# Altium project D_amplifier.PrjPcb (part 2 of 3)
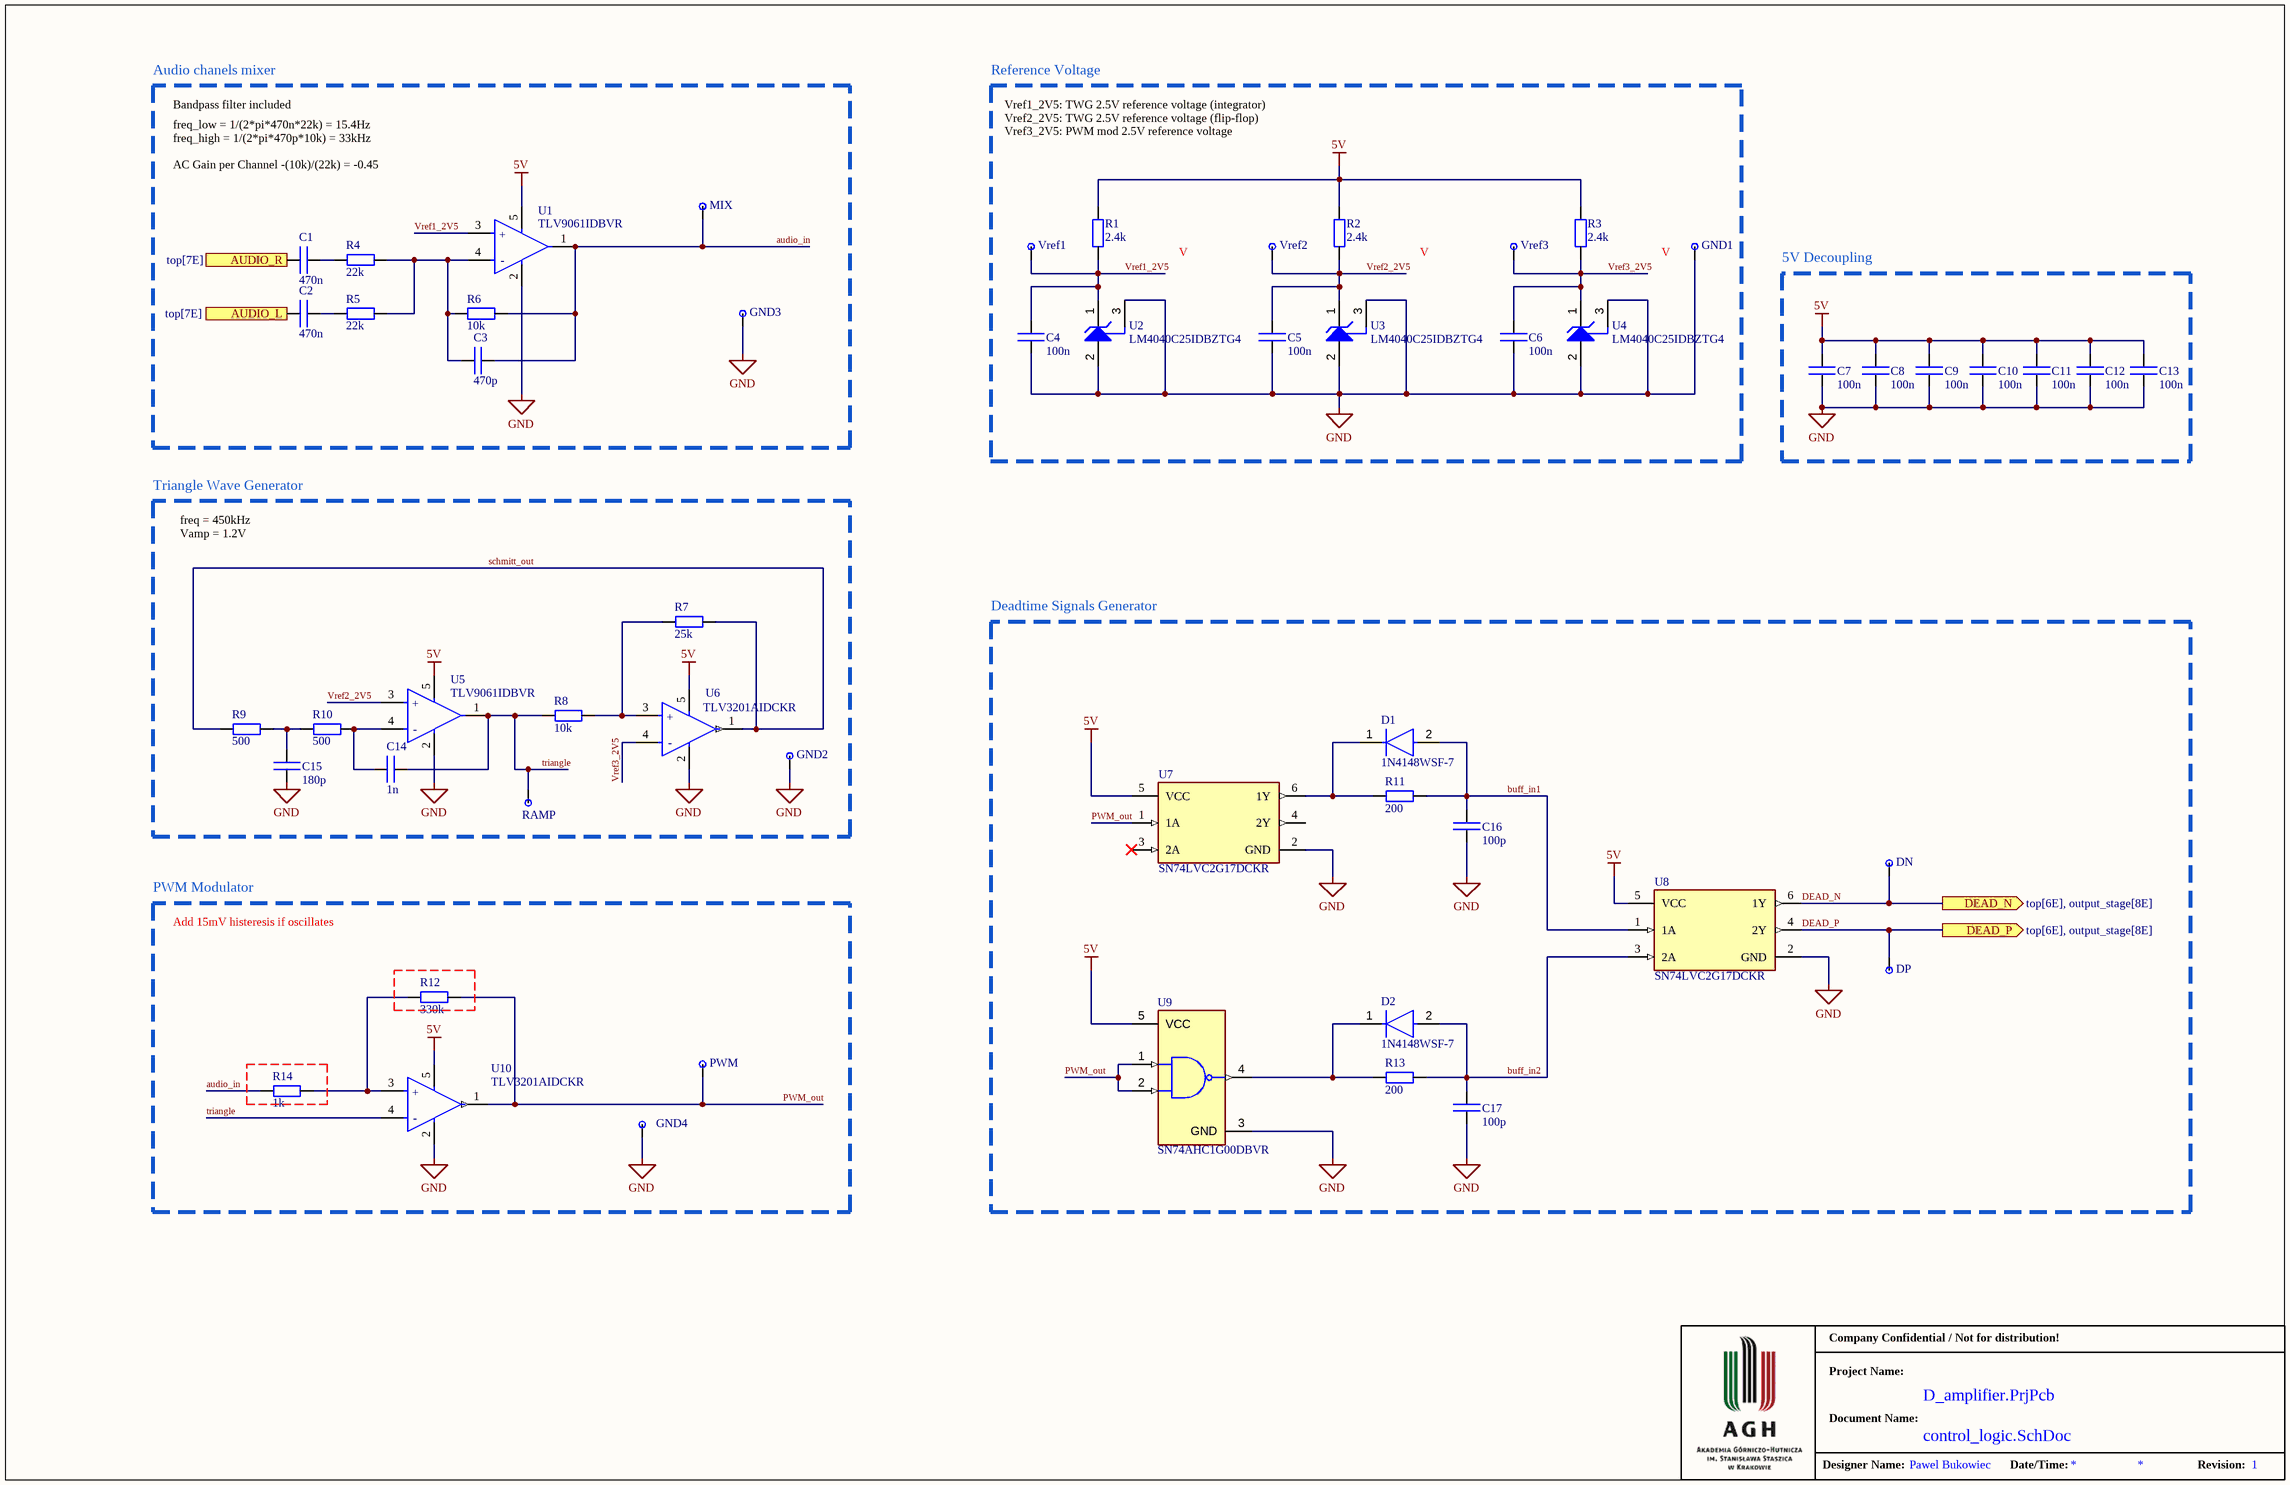
[diagram p5: control_logic.SchDoc]

## Sheet control_logic.SchDoc (continued)

### Parts
C1  470n  [CAP_1206]
C2  470n  [CAP_1206]
C3  470p  [CAP_IPC_0805_133A]
C4  100n  [CAP_IPC_0805_133A]
C5  100n  [CAP_IPC_0805_133A]
C6  100n  [CAP_IPC_0805_133A]
C7  100n  [CAP_IPC_0805_133A]
C8  100n  [CAP_IPC_0805_133A]
C9  100n  [CAP_IPC_0805_133A]
C10  100n  [CAP_IPC_0805_133A]
C11  100n  [CAP_IPC_0805_133A]
C12  100n  [CAP_IPC_0805_133A]
C13  100n  [CAP_IPC_0805_133A]
C14  1n  [CAP_IPC_0805_133A]
C15  180p  [CAP_IPC_0805_133A]
C16  100p  [CAP_IPC_0805_133A]
C17  100p  [CAP_IPC_0805_133A]
D1  1N4148WSF-7  [1N4148]
D2  1N4148WSF-7  [1N4148]
DN  TestPoint  [TestPoint_SMT]  (value not drawn)
DP  TestPoint  [TestPoint_SMT]  (value not drawn)
GND1  TestPoint  [TestPoint_SMT]  (value not drawn)
GND2  TestPoint  [TestPoint_SMT]  (value not drawn)
GND3  TestPoint  [TestPoint_SMT]  (value not drawn)
GND4  TestPoint  [TestPoint_SMT]  (value not drawn)
MIX  TestPoint  [TestPoint_SMT]  (value not drawn)
PWM  TestPoint  [TestPoint_SMT]  (value not drawn)
R1  2.4k  [RES_VJ_0402_MD]
R2  2.4k  [RES_VJ_0402_MD]
R3  2.4k  [RES_VJ_0402_MD]
R4  22k  [RES_VJ_0402_MD]
R5  22k  [RES_VJ_0402_MD]
R6  10k  [RES_VJ_0402_MD]
R7  25k  [RES_VJ_0402_MD]
R8  10k  [RES_VJ_0402_MD]
R9  500  [RES_VJ_0402_MD]
R10  500  [RES_VJ_0402_MD]
R11  200  [RES_VJ_0402_MD]
R12  330k  [RES_VJ_0402_MD]
R13  200  [RES_VJ_0402_MD]
R14  1k  [RES_VJ_0402_MD]
RAMP  TestPoint  [TestPoint_SMT]  (value not drawn)
U1  TLV9061IDBVR  [TLV9061]
U2  LM4040C25IDBZTG4  [LM4040C25]
U3  LM4040C25IDBZTG4  [LM4040C25]
U4  LM4040C25IDBZTG4  [LM4040C25]
U5  TLV9061IDBVR  [TLV9061]
U6  TLV3201AIDCKR  [TLV3201]
U7  SN74LVC2G17DCKR  [SN74LVC2G17DCKR]
U8  SN74LVC2G17DCKR  [SN74LVC2G17DCKR]
U9  SN74AHC1G00DBVR  [SN74AHC1G00DBVR]
U10  TLV3201AIDCKR  [TLV3201]
Vref1  TestPoint  [TestPoint_SMT]  (value not drawn)
Vref2  TestPoint  [TestPoint_SMT]  (value not drawn)
Vref3  TestPoint  [TestPoint_SMT]  (value not drawn)

### Blocks framed on the sheet
Audio chanels mixer: C1-C3 GND3 MIX R4-R6 U1
Reference Voltage: C4-C6 GND1 R1-R3 U2-U4 Vref1-Vref3
5V Decoupling: C7-C13
Triangle Wave Generator: C14 C15 GND2 R7-R10 RAMP U5 U6
Deadtime Signals Generator: C16 C17 D1 D2 DN DP R11 R13 U7-U9
PWM Modulator: GND4 PWM R12 R14 U10

### Ports
AUDIO_L (in, see top[7E]), AUDIO_R (in, see top[7E]), DEAD_N (out, see top[6E], output_stage[8E]), DEAD_P (out, see top[6E], output_stage[8E])

### Nets
5V: C7.1 C8.1 C9.1 C10.1 C11.1 C12.1 C13.1 R1.1 R2.1 R3.1 U1.5(V+) U5.5(V+) U6.5(VCC) U7.5(VCC) U8.5(VCC) U9.5(VCC) U10.5(VCC)
GND: C4.2 C5.2 C6.2 C7.2 C8.2 C9.2 C10.2 C11.2 C12.2 C13.2 C15.2 C16.2 C17.2 GND1.1 GND2.1 GND3.1 GND4.1 U1.2(V-) U2.2(ANODE) U2.3(NC) U3.2(ANODE) U3.3(NC) U4.2(ANODE) U4.3(NC) U5.2(V-) U6.2(GND) U7.2(GND) U8.2(GND) U9.3(GND) U10.2(GND)
AUDIO_CH_L: C2.1 ; port AUDIO_L
AUDIO_CH_R: C1.1 ; port AUDIO_R
audio_in: C3.2 MIX.1 R6.2 R14.1 U1.1(OUT)
buff_in1: C16.1 D1.2(A) R11.2 U8.1(1A)
buff_in2: C17.1 D2.2(A) R13.2 U8.3(2A)
DEAD_N: DN.1 U8.6(1Y) ; port DEAD_N
DEAD_P: DP.1 U8.4(2Y) ; port DEAD_P
PWM_out: PWM.1 R12.2 U7.1(1A) U9.1(A) U9.2(B) U10.1(OUT)
schmitt_out: R7.2 R9.1 U6.1(OUT)
triangle: C14.2 R8.1 RAMP.1 U5.1(OUT) U10.4(IN-)
Vref1_2V5: C4.1 R1.2 U1.3(IN+) U2.1(CATHODE) Vref1.1
Vref2_2V5: C5.1 R2.2 U3.1(CATHODE) U5.3(IN+) Vref2.1
Vref3_2V5: C6.1 R3.2 U4.1(CATHODE) U6.4(IN-) Vref3.1
NetC1_2: C1.2 R4.1
NetC2_2: C2.2 R5.1
NetC3_1: C3.1 R4.2 R5.2 R6.1 U1.4(IN-)
NetC14_1: C14.1 R10.2 U5.4(IN-)
NetC15_1: C15.1 R9.2 R10.1
NetD1_1: D1.1(C) R11.1 U7.6(1Y)
NetD2_1: D2.1(C) R13.1 U9.4(Y)
NetR7_1: R7.1 R8.2 U6.3(IN+)
NetR12_1: R12.1 R14.2 U10.3(IN+)

Not connected (* = marked no-connect by the designer): U7 3(2A)* 4(2Y)

### Notes on the sheet
- Bandpass filter included
- freq_low = 1/(2*pi*470n*22k) = 15.4Hz
- freq_high = 1/(2*pi*470p*10k) = 33kHz
- AC Gain per Channel -(10k)/(22k) = -0.45
- Vref1_2V5: TWG 2.5V reference voltage (integrator)
- Vref2_2V5: TWG 2.5V reference voltage (flip-flop)
- Vref3_2V5: PWM mod 2.5V reference voltage
- freq = 450kHz
- Vamp = 1.2V
- Add 15mV histeresis if oscillates
- Project Name:
- Company Confidential / Not for distribution!
- Document Name:
- Designer Name:
- Date/Time:
- Revision:
- (in symbol TLV3201) +
- (in symbol TLV9061) +; -

### Library data of the parts
C1 C2 = Capacitor: Manufacturer: *; Part Number: *; Value: 470n
C3 = Capacitor: Dielectric: C0G; Voltage: 10; Manufacturer: *; Part Number: *; Value: 470p
C4-C13 = Capacitor: Dielectric: X7R; Voltage: 16; Manufacturer: *; Part Number: *; Value: 100n
C14 C15 = Capacitor: Dielectric: C0G; Volatge: 16; Manufacturer: *; Part Number: *
  C14: Value: 1n
  C15: Value: 180p
C16 C17 = Capacitor: Dielectric: C0G; Volatge: 10; Manufacturer: *; Part Number: *; Value: 100p
D1 D2 = 1N4148: DIODE GEN PURP 100V 250MA SOD323; Manufacturer: Diodes Inc.; Value: 1.5pF; Max Surge Forward Current: 0.5A; Peak Reverse Current: 0.5uA; Max Junction Temp: +150°C; Height: 0.75mm; Digikey Description: DIODE GEN PURP 100V 250MA SOD323; Automotive: No; Footprint Url: https://www.diodes.com/assets/Package-Files/SOD323F.pdf; Category: Diode; Manufacturer Part Number: 1N4148WSF-7; Max Repetitive Reverse Voltage: 100V; Lead Free: Yes; Temperature Range High: +150°C; Forward Current: 250mA; Reverse Voltage: 100V; Device Class L3: Rectifier Diodes; ComponentLink2URL: https://www.diodes.com/assets/Datasheets/1N4148WSF.pdf; Package: SOD323F; RoHS: TRUE; Mouser Description: Diodes - General Purpose, Power, Switching 200mW 2pF 75Vrrm 150mA 2A 1VF; Temperature: -55°C to +150°C; Capacitance: 1.5pF; Device Class L2: Diodes; ComponentLink2Description: Datasheet; Device Class L1: Discrete Semiconductors; Octopart: https://octopart.com/1n4148wsf-7-diodes+inc.-33798544; Temperature Range Low: -55°C
DN DP GND1-GND4 MIX PWM RAMP Vref1-Vref3 = TestPoint: Test Point
R1-R14 = Resistor: Manufacturer: *; Part Number: *; ComponentLink1Description: HelpURL; ComponentLink1URL: *
  R1-R3: Value: 2.4k
  R4 R5: Value: 22k
  R6 R8: Value: 10k
  R7: Value: 25k
  R9 R10: Value: 500
  R11 R13: Value: 200
  R12: Value: 330k
  R14: Value: 1k
U1 U5 = TLV9061: IC CMOS 1 CIRCUIT SOT23-5; Gain Bandwidth Product: 10MHz; Operating Supply Current: 538uA; Output Current per Channel: 50mA; Number of Circuits: 1; Input Bias Current: 0.5pA; Input Offset Voltage (Vos): 300uV; Slew Rate: 6.5V/µs; Min Operating Temperature: -40°C; Packaging: Cut Tape; RoHS Compliant: Yes; Mount: Surface Mount; Max Operating Temperature: 125°C; Case/Package: SOT-23-6
U2-U4 = LM4040C25: Precision Micropower Shunt Voltage Reference, 0.5% accuracy, 2.5 V, 15 ppm / degC, 15 mA, -40 to 85 degC, 3-pin SOT-23 (DBZ), Green (RoHS & no Sb/Br); Manufacturer: Texas Instruments; Temp Coeff(Max)(ppm/ degree C): 100; VO(V): 2.5; Rating: Catalog; Min Iz for Regulation(uA): 75; Temp Coeff(Typ)(ppm/ degree C): 15; Initial Accuracy @ 25/deg C(%): 0.5; PartNumber: LM4040C25IDBZTG4; PackageDescription: 3-Pin Plastic Small Outline, Body 2.92 x 1.3 mm, Pitch 0.95 mm; PackageVersion: 4203227/B; ComponentLink3URL: http://www.ti.com/litv/pdf/mpds108a; ComponentLink2URL: http://www.ti.com/general/docs/lit/getliterature.tsp?genericPartNumber=LM4040C25&fileType=pdf; Mounting Technology: Surface Mount; ComponentLink3Description: Package Specification; ComponentLink1URL: http://www.ti.com/; DatasheetVersion: SLOS456K; PackageReference: DBZ3; ComponentLink1Description: Manufacturer URL; Eco-Plan: Green (RoHS & no Sb/Br); SubFamily: Shunt Voltage Reference; Code_JEDEC: TO-236; Iout/Iz(Max)(mA): 15; ComponentLink2Description: Datasheet
U6 U10 = TLV3201: IC COMPARATOR RRI SGL SC70-5; Output Type: PUSH-PULL; Max Supply Current: 40uA; Nominal Supply Current: 50uA; Propagation Delay: 50ns; Max Input Current: 5nA; Input Offset Voltage (Vos): 5mV; Number of Channels: 1; Power Supply Rejection Ratio (PSRR): 85dB; Hysteresis: 1.2mV; Min Supply Voltage: 2.7V; Max Supply Voltage: 5.5V; Response Time: 0.047us; Series: -; Case/Package: SOT-23-5; Packaging: Tape and Reel; Number of Pins: 5; RoHS Compliant: Yes; Min Operating Temperature: -40°C; Mount: Surface Mount; Radiation Hardening: No; Number of Elements: 1; Input Bias Current: 5nA; Lead Free: Lead Free; Max Operating Temperature: 125°C; Supply Current: 50uA; Type: General Purpose; Common Mode Rejection Ratio: 85dB; Package Quantity: 3000; Quiescent Current: 40uA
U7 U8 = SN74LVC2G17DCKR: IC BUF NON-INVERT 5.5V SC70-6; Schmitt Trigger Input: Yes; Number of Inputs: 2; Propagation Delay: 4.3ns; Number of Bits per Element: 1; Logic Function: Schmitt Trigger; Polarity: Non-Inverting; Low Level Output Current: 32mA; High Level Output Current: -32mA; Min Supply Voltage: 1.65V; Nominal Supply Current: 250mA; Quiescent Current: 10uA; Turn-On Delay Time: 9.3ns; Number of Pins: 6; Number of Channels: 2; Length: 2mm; Min Operating Temperature: -40°C; Contact Plating: Gold; Lead Free: Lead Free; Termination: SMD/SMT; Width: 1.25mm; Package Quantity: 1; REACH SVHC: No SVHC; Number of Bits: 2; Max Supply Voltage: 5.5V; Number of Output Lines: 2; Mount: Surface Mount; Number of Circuits: 2; Packaging: Tape and Reel; Case/Package: SC; Number of Input Lines: 2; Number of Gates: 2; RoHS Compliant: Yes; Height: 0.9mm; Max Operating Temperature: 125°C; Number of Elements: 2; Number of Outputs: 2; Radiation Hardening: No
U9 = SN74AHC1G00DBVR: IC GATE NAND 1CH 2-INP SOT23-5; Manufacturer: Texas Instruments; Standoff Height: 0mm; Number Of Outputs: 1; Nominal Supply Current: 1uA; Max Junction Temp: +150°C; Propagation Delay: 5.2ns; Min Supply Voltage: 2V; Max Supply Voltage: 5.5V; Number Of Inputs: 2; Category: IC; Logic Function Desc: NAND; Ambient Temperature Range High: +125°C; Automotive: No; Octopart: https://octopart.com/sn74ahc1g00dbvr-texas+instruments-464400; Device Class L1: Integrated Circuits (ICs); Device Class L2: Logic ICs; RoHS: TRUE; Height: 1.45mm; Digikey Description: IC GATE NAND 1CH 2-INP SOT23-5; Lead Free: Yes; Ambient Temperature Range Low: -40°C; Number Of Circuits: 1; Device Class L3: Logic Gates; Package: DBV0005A; Manufacturer Part Number: SN74AHC1G00DBVR; ComponentLink2URL: https://www.ti.com/lit/ds/symlink/sn74ahc1g00.pdf; Temperature Range Low: -40°C; Temperature: -40°C to +125°C; Temperature Range High: +125°C; ComponentLink2Description: Datasheet

## Sheet output_stage.SchDoc
size 431 x 279 mm; Author: Pawel Bukowiec; Organization: ORGANIZATION; Address1: ADDRESS 1; Address2: ADDRESS 2; Address3: ADDRESS 3; Address4: ADDRESS 4; Revision: 1; SheetNumber: 5; SheetTotal: 5; ENG_APP_DATE: --/--/--; DSN_APP_DATE: --/--/--; CHK_APP_DATE: --/--/--; SPICEModelCacheNCNDFIAY: <root> / <DocumentId>NCNDFIAY</DocumentId> / <CacheFrame Number="0"> / <Model Name="irfz24n" Kind="CKT"> / <Text>.SUBCKT irfz24n 1 2 3 / ************************************** / *      Model Generated by MODPEX     * / *Copyright(c) Symmetry Design Systems* / *         All Rights Reserved        * / *    UNPUBLISHED LICENSED SOFTWARE   * / *   Contains Proprietary Information * / *      Which is The Property of      * / *     SYMMETRY OR ITS LICENSORS      * / *Commercial Use or Resale Restricted * / *   by Symmetry License Agreement    * / ************************************** / * Model generated on Apr 24, 96 / * Model format: SPICE3 / * Symmetry POWER MOS Model (Version 1.0) / * External Node Designations / * Node 1 -&gt; Drain / * Node 2 -&gt; Gate / * Node 3 -&gt; Source / M1 9 7 8 8 MM L=100u W=100u / * Default values used in MM: / * The voltage-dependent capacitances are / * not included. Other default values are: / *   RS=0 RD=0 LD=0 CBD=0 CBS=0 CGBO=0 / .MODEL MM NMOS LEVEL=1 IS=1e-32 / +VTO=3.6319 LAMBDA=0 KP=8.99346 / +CGSO=3.09714e-06 CGDO=1.6185e-07 / RS 8 3 0.0409355 / D1 3 1 MD / .MODEL MD D IS=1.43387e-10 RS=0.0112766 N=1.28803 BV=55 / +IBV=0.00025 EG=1.2 XTI=2.96465 TT=0 / +CJO=2.96476e-10 VJ=0.50803 M=0.3 FC=0.5 / RDS 3 1 2.2e+06 / RD 9 1 0.0001 / RG 2 7 2.4575 / D2 4 5 MD1 / * Default values used in MD1: / *   RS=0 EG=1.11 XTI=3.0 TT=0 / *   BV=infinite IBV=1mA / .MODEL MD1 D IS=1e-32 N=50 / +CJO=4.37817e-10 VJ=0.5 M=0.578699 FC=1e-08 / D3 0 5 MD2 / * Default values used in MD2: / *   EG=1.11 XTI=3.0 TT=0 CJO=0 / *   BV=infinite IBV=1mA / .MODEL MD2 D IS=1e-10 N=0.4 RS=3e-06 / RL 5 10 1 / FI2 7 9 VFI2 -1 / VFI2 4 0 0 / EV16 10 0 9 7 1 / CAP 11 10 6.81971e-10 / FI1 7 9 VFI1 -1 / VFI1 11 6 0 / RCAP 6 10 1 / D4 0 6 MD3 / * Default values used in MD3: / *   EG=1.11 XTI=3.0 TT=0 CJO=0 / *   RS=0 BV=infinite IBV=1mA / .MODEL MD3 D IS=1e-10 N=0.4 / .ENDS</Text> / </Model> / <Model Name="and2_basic_gen" Kind="CKT"> / <Text>*$ / .SUBCKT AND2_BASIC_GEN A B Y PARAMS: VDD=1 VSS=0 VTHRESH=0.5 / E_ABMGATE    YINT 0 VALUE {{IF(V(A) &gt; {VTHRESH}  &amp; / + V(B) &gt; {VTHRESH},{VDD},{VSS})}} / RINT YINT Y 1 / CINT Y 0 1n / .ENDS AND2_BASIC_GEN</Text> / </Model> / <Model Name="comphys_basic_gen" Kind="CKT"> / <Text>*$ / .SUBCKT COMPHYS_BASIC_GEN INP INM HYS OUT PARAMS: VDD=1 VSS=0 VTHRESH=0.5 / EIN INP1 INM1 INP INM 1 / EHYS INP1 INP2 VALUE { IF( V(1) &gt; {VTHRESH},-V(HYS),0) } / EOUT OUT 0 VALUE { IF( V(INP2)&gt;V(INM1), {VDD} ,{VSS}) } / R1 OUT 1 1 / C1 1 0 5.0n / RINP1 INP1 0 1K / .ENDS COMPHYS_BASIC_GEN</Text> / </Model> / <Model Name="nmos01" Kind="MDL"> / <Text>*$ / ** Wrapper definitions for AA legacy support ** / ****************************** / .model NMOS01 nmos / + vto=2 / + kp=0.55 / + lambda=0.001</Text> / </Model> / <Model Name="buf_basic_gen" Kind="CKT"> / <Text>*$ / .SUBCKT BUF_BASIC_GEN A  Y PARAMS: VDD=1 VSS=0 VTHRESH=0.5 / E_ABMGATE    YINT 0 VALUE {{IF(V(A) &gt; {VTHRESH} , / + {VDD},{VSS})}} / RINT YINT Y 1 / CINT Y 0 1n / .ENDS BUF_BASIC_GEN</Text> / </Model> / <Model Name="falling_delay" Kind="CKT"> / <Text>****************************** / *$ / .subckt falling_delay in out params: delay=100n vdd=1 vss=0 vthresh=0.5 / x_u1         int out buf_basic_gen params: vdd={vdd} vss={vss} vthresh= / + {vthresh} / r_r1         in int  {delay/(0.693 * 1e-9)} / c_c1         0 int  1n / d_d1         in int dd / .model dd d / + is=1e-015 / + n=1 / + tt=1e-011 / .ends falling_delay</Text> / <Dependency>0\buf_basic_gen</Dependency> / </Model> / <Model Name="nsw_ps" Kind="CKT"> / <Text>*$ / .SUBCKT NSW_PS D G S PARAMS: RONval=10k VTHval=0.7 VCHARval=0.01 CGval=0.01pF CDval=0.01pF CSval=0.01pf / RDDUM D 0 1e11 / RSDUM S 0 1e11 / RGDUM G 0 1e11 / CG G D {CGval} / CD D S {CDval} / CS G S {CSval} / ***EEXP F1 0 VALUE={LIMIT(((V(G,S)-VTHval)/VCHARval),-80,80)} / Etest test 0 VALUE={IF(V(D) &gt; V(S), V(G,S), V(G,D))} / GOUT D S VALUE={V(D,S)/(RONval*(1+EXP(-LIMIT(((V(test)-VTHval)/VCHARval),-80,80))))} / .ENDS NSW_PS</Text> / </Model> / <Model Name="psw_ps" Kind="CKT"> / <Text>*$ / .SUBCKT PSW_PS D G S PARAMS: RONval=10k VTHval=0.7 VCHARval=0.01 CGval=0.01pF CDval=0.01pF / RDDUM D 0 1e11 / RSDUM S 0 1e11 / RGDUM G 0 1e11 / CG G D {CGval} / CD D S {CDval} / Etest test 0 VALUE={IF(V(S) &gt; V(D), V(S,G), V(D,G))} / GOUT S D VALUE={V(S,D)/(RONval*(1+EXP(-LIMIT(((V(test)-VTHval)/VCHARval),-80,80))))} / .ENDS PSW_PS</Text> / </Model> / <Model Name="buffer_ps" Kind="CKT"> / <Text>*$ / .SUBCKT BUFFER_PS A Y PARAMS: vhi=1 vlo=0 vthresh=500e-3 tplh=1e-9 tphl=1e-9 tr=1e-9 tf=1e-9 / RA A 0 1e11 / CA A 0 0.01pF / VS VSUP 0 DC 1 / EBUF1 Ypp 0 VALUE={IF(V(A) &gt; ({vthresh}), 1, 0)} / ROUTpp Ypp 0 1e11 / XNSW1 OUTp Ypp 0 NSW_PS PARAMS: RONval={(tplh+1e-15)/(1e-12*0.693)} VTHval=0.5 / XPSW1 OUTp Ypp VSUP PSW_PS PARAMS: RONval={(tphl+1e-15)/(1e-12*0.693)} VTHval=0.5 / CDEL1 OUTp 0 1pF / ETHRESH Yp 0 VALUE={IF(V(OUTp) &gt; 0.5, 1, 0)} / ROUTp Yp 0 1e11 / XNSW2 OUTr Yp 0 NSW_PS PARAMS: RONval={(tf+1e-15)/(1e-12*2.3)} VTHval=0.5 / XPSW2 OUTr Yp VSUP PSW_PS PARAMS: RONval={(tr+1e-15)/(1e-12*2.3)} VTHval=0.5 / CDEL2 OUTr 0 1pF / EOUT OUTf 0 VALUE={V(OUTr)*({vhi} - {vlo})+{vlo}} / RDR OUTf Y  1000 / RO Y 0 1e11 / .ENDS BUFFER_PS</Text> / <Dependency>0\nsw_ps</Dependency> / <Dependency>0\psw_ps</Dependency> / </Model> / <Model Name="pmos01" Kind="MDL"> / <Text>*$ / ****************************** / .model PMOS01 pmos / + vto=-2 / + kp=0.772 / + lambda=0.001</Text> / </Model> / <Model Name="d_d1" Kind="CKT"> / <Text>*$ / ****************************** / .subckt d_d1 1 2 / d1 1 2 dd1 / .model dd1 d / + is=1e-015 / + tt=1e-011 / + rs=0.05 / + n=1 / .ends d_d1</Text> / </Model> / <Model Name="and3_basic_gen" Kind="CKT"> / <Text>*$ / .SUBCKT AND3_BASIC_GEN A B C Y PARAMS: VDD=1 VSS=0 VTHRESH=0.5 / E_ABMGATE    YINT 0 VALUE {{IF(V(A) &gt; {VTHRESH}  &amp; / + V(B) &gt; {VTHRESH} &amp; / + V(C) &gt; {VTHRESH},{VDD},{VSS})}} / RINT YINT Y 1 / CINT Y 0 1n / .ENDS AND3_BASIC_GEN</Text> / </Model> / <Model Name="nand2_basic_gen" Kind="CKT"> / <Text>*$ / .SUBCKT NAND2_BASIC_GEN A B Y PARAMS: VDD=1 VSS=0 VTHRESH=0.5 / E_ABMGATE    YINT 0 VALUE {{IF(V(A) &gt; {VTHRESH}  &amp; / + V(B) &gt; {VTHRESH},{VSS},{VDD})}} / RINT YINT Y 1 / CINT Y 0 1n / .ENDS NAND2_BASIC_GEN</Text> / </Model> / <Model Name="ucc27282" Kind="CKT"> / <Text>* * source UCC27282 / ***************************************************************************** / * (C) Copyright 2018 Texas Instruments Incorporated. All rights reserved. / ***************************************************************************** / ** This model is designed as an aid for customers of Texas Instruments. / ** TI and its licensors and suppliers make no warranties, either expressed / ** or implied, with respect to this model, including the warranties of / ** merchantability or fitness for a particular purpose. The model is / ** provided solely on an "as is" basis. The entire risk as to its quality / ** and performance is with the customer. / ***************************************************************************** / * / * Released by: WEBENCH Design Center, Texas Instruments Inc. / * Part: UCC27282 / * Date: 10/31/2018 / * Model Type: Transient / * Simulator: PSPICE / * Simulator Version: 16.2 / * EVM Order Number: / * EVM Users Guide: SLUUBM2 / * Datasheet: SNVSAQ5 / * Model Version: Final 1.0 / * Release to Web. / **************************************************************** / *$ / .SUBCKT UCC27282 LI HI EN VDD VSS HB  HO HS  LO / E_U1_E2         HO U1_N16706734 VALUE { IF(V(U1_N16706930, 0) &gt; 0.5, -5, 5) } / R_U1_R9         U1_N16707490 U1_N16707354  50 / V_U1_V10         U1_N16706152 0 0.5 / X_U1_U15         EN U1_N16711349 U1_N16711355 U1_N16713299 COMPHYS_BASIC_GEN / +  PARAMS: VDD=1 VSS=0 VTHRESH=0.5 / E_U1_E6         U1_HI_ON VSS U1_N16708422 VSS 1 / E_U1_E1         U1_N16707534 U1_HOH VALUE { IF(V(U1_HI_ON, 0) &gt; 0.5, 5, -5) } / X_U1_U16         U1_N16712773 U1_N16713299 U1_N16707820 AND2_BASIC_GEN PARAMS: / +  VDD=1 VSS=0 VTHRESH=.5 / X_U1_U4         U1_N16706536 U1_UVLOHI U1_N16708416 AND2_BASIC_GEN PARAMS: / +  VDD=1 VSS=0 VTHRESH=.5 / C_U1_C6         HO U1_N16706748  7.5p / X_U1_U5         HI U1_N16706446 U1_N16706474 U1_N16706240 COMPHYS_BASIC_GEN / +  PARAMS: VDD=1 VSS=0 VTHRESH=0.5 / E_U1_E7         U1_N16708078 VSS HB HS 1 / M_U1_M1         U1_N16707574 U1_N16707548 U1_HOH U1_HOH NMOS01 / C_U1_C7         U1_N16707366 U1_N16707354  12.5p / R_U1_R11         U1_HOH HO  1m / X_U1_U7         U1_HI_ON U1_N16706930 falling_delay PARAMS:  DELAY=1n VDD=1 / +  VSS=0 VTHRESH=0.5 / R_U1_R10         U1_N16707366 VSS  0.02 / V_U1_V3         U1_N16706446 VSS 2.1 / C_U1_C1         U1_N16707548 U1_N16707574  20p / E_U1_E5         U1_LO_ON VSS U1_N16708190 VSS 1 / X_U1_U11         U1_N16708416 U1_N16708422 BUFFER_PS PARAMS: VHI=1 VLO=0 / +  VTHRESH=500E-3 TPLH={Thplh} TPHL={Thphl} TR=1E-9 TF=1E-9 / X_U1_U6         VDD HB d_d1 PARAMS: / ***X_U1_U6         0 0  d_d1 PARAMS: / V_U1_V4         U1_N16706474 0 1 / C_U1_C3         U1_HOH U1_N16707548  5p / C_U1_C8         LO U1_N16707354  7.5p / R_U1_R4         HB U1_N16707574  0.02 / X_U1_U17         U1_N16706240 U1_LOCK U1_N16707820 U1_UVLOHI AND3_BASIC_GEN / +  PARAMS: VDD=1 VSS=0 VTHRESH=500E-3 / X_U1_U12         U1_UVLOLOW U1_N16708190 BUFFER_PS PARAMS: VHI=1 VLO=0 / +  VTHRESH=500E-3 TPLH={Tlplh} TPHL={Tlphl} TR=1E-9 TF=1E-9 / E_U1_E4         U1_N16707138 U1_LOH VALUE { IF(V(U1_LO_ON, 0) &gt; 0.5, 5, -5) } / R_U1_R7         U1_N16707138 U1_N16707192  50 / R_U1_R12         U1_LOH LO  1m / M_U1_M4         U1_N16707366 U1_N16707354 LO LO PMOS01 / M_U1_M2         U1_N16706782 U1_N16706748 HO HO PMOS01 / R_U1_R2         VSS HI  250k / V_U1_V11         U1_N16711349 VSS 1.8 / R_U1_R5         U1_N16706734 U1_N16706748  50 / X_U1_U13         HB U1_N16708226 U1_N16708274 U1_N16706536 COMPHYS_BASIC_GEN / +  PARAMS: VDD=1 VSS=0 VTHRESH=0.5 / M_U1_M3         U1_N16707204 U1_N16707192 U1_LOH U1_LOH NMOS01 / V_U1_V1         U1_N16706306 VSS 2.1 / X_U1_U9         U1_N16708078 U1_N16707998 U1_N16708046 N16718557 / +  COMPHYS_BASIC_GEN PARAMS: VDD=1 VSS=0 VTHRESH=0.5 / X_U1_U8         U1_LO_ON U1_N16707522 falling_delay PARAMS:  DELAY=1n VDD=1 / +  VSS=0 VTHRESH=0.5 / V_U1_V12         U1_N16711355 0 0.4 / C_U1_C4         U1_N16707192 U1_N16707204  20p / V_U1_V7         U1_N16708226 0 3.7 / E_U1_E3         LO U1_N16707490 VALUE { IF(V(U1_N16707522, 0) &gt; 0.5, -5, 5) } / C_U1_C2         U1_N16706782 U1_N16706748  12.5p / X_U1_U14         VDD U1_N16706124 U1_N16706152 U1_N16712773 COMPHYS_BASIC_GEN / +  PARAMS: VDD=1 VSS=0 VTHRESH=0.5 / V_U1_V2         U1_N16706332 0 1 / V_U1_V5         U1_N16707998 0 3.55 / C_U1_C5         U1_LOH U1_N16707192  5p / R_U1_R13         VSS EN  200k / V_U1_V8         U1_N16708274 0 0.4 / R_U1_R6         U1_N16706782 HS  0.02 / X_U1_U10         LI U1_N16706306 U1_N16706332 U1_N16706526 COMPHYS_BASIC_GEN / +  PARAMS: VDD=1 VSS=0 VTHRESH=0.5 / X_U1_U20         HI LI U1_LOCK NAND2_BASIC_GEN PARAMS: VDD=1 VSS=0 / +  VTHRESH=500E-3 / R_U1_R8         VDD U1_N16707204  0.02 / V_U1_V6         U1_N16708046 0 0.1 / R_U1_R1         VSS LI  250k / V_U1_V9         U1_N16706124 VSS 5 / R_U1_R3         U1_N16707534 U1_N16707548  50 / X_U1_U18         U1_N16707820 U1_LOCK U1_N16706526 U1_UVLOLOW AND3_BASIC_GEN / +  PARAMS: VDD=1 VSS=0 VTHRESH=500E-3 / .PARAM  thplh=10n tlphl=8.2n thphl=8n tlplh=10.5n / .ends UCC27282</Text> / <Dependency>0\and2_basic_gen</Dependency> / <Dependency>0\comphys_basic_gen</Dependency> / <Dependency>0\nmos01</Dependency> / <Dependency>0\falling_delay</Dependency> / <Dependency>0\buffer_ps</Dependency> / <Dependency>0\pmos01</Dependency> / <Dependency>0\d_d1</Dependency> / <Dependency>0\and3_basic_gen</Dependency> / <Dependency>0\nand2_basic_gen</Dependency> / </Model> / </CacheFrame> / </root>
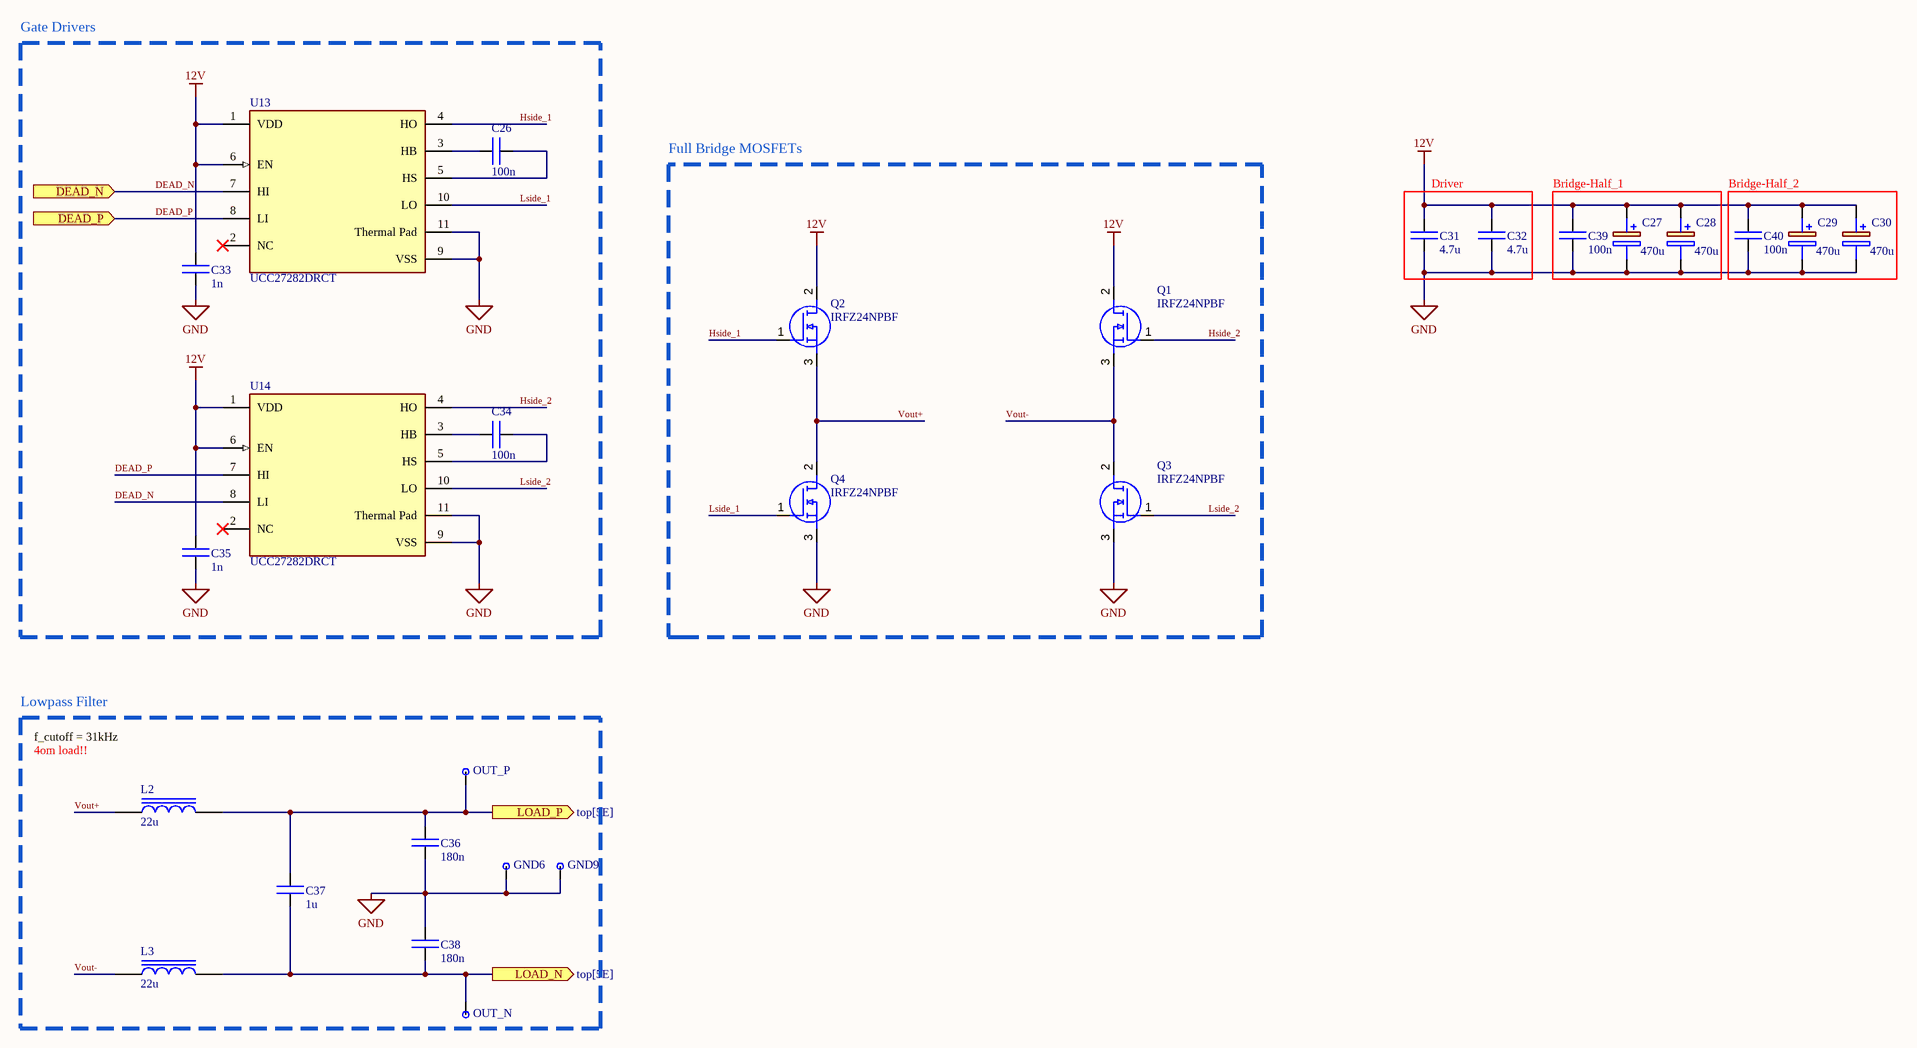
[diagram p3: output_stage.SchDoc]

### Parts
C26  100n  [CAP_IPC_0805_133A]
C27  470u  [EEEFK1V331P]
C28  value 470u  [EEEFK1V331P]  (hidden comment: EEEFK1E471P)
C29  value 470u  [EEEFK1V331P]  (hidden comment: EEEFK1E471P)
C30  value 470u  [EEEFK1V331P]  (hidden comment: EEEFK1E471P)
C31  4.7u  [CAP_IPC_0805_133A]
C32  4.7u  [CAP_IPC_0805_133A]
C33  1n  [CAP_IPC_0805_133A]
C34  100n  [CAP_IPC_0805_133A]
C35  1n  [CAP_IPC_0805_133A]
C36  180n  [CAP_IPC_0805_133A]
C37  1u  [CAP_IPC_0805_133A]
C38  180n  [CAP_IPC_0805_133A]
C39  100n  [CAP_IPC_0805_133A]
C40  100n  [CAP_IPC_0805_133A]
GND6  TestPoint  [TestPoint_SMT]  (value not drawn)
GND9  TestPoint  [TestPoint_SMT]  (value not drawn)
L2  22u  [SRR1208-220ML]
L3  22u  [SRR1208-220ML]
OUT_N  TestPoint  [TestPoint_SMT]  (value not drawn)
OUT_P  TestPoint  [TestPoint_SMT]  (value not drawn)
Q1  IRFZ24NPBF  [IRFZ24NPBF]
Q2  IRFZ24NPBF  [IRFZ24NPBF]
Q3  IRFZ24NPBF  [IRFZ24NPBF]
Q4  IRFZ24NPBF  [IRFZ24NPBF]
U13  UCC27282DRCT  [UCC27282]
U14  UCC27282DRCT  [UCC27282]

### Blocks framed on the sheet
Gate Drivers: C26 C33-C35 U13 U14
Full Bridge MOSFETs: Q1-Q4
Driver: C31 C32
Bridge-Half_1: C27 C28 C39
Bridge-Half_2: C29 C30 C40
Lowpass Filter: C36-C38 GND6 GND9 L2 L3 OUT_N OUT_P

### Ports
DEAD_N (in, see top[6E], control_logic[2C]), DEAD_P (in, see top[6E], control_logic[2C]), LOAD_N (out, see top[5E]), LOAD_P (out, see top[5E])

### Nets
12V: C27.1(+) C28.1(+) C29.1(+) C30.1(+) C31.1 C32.1 C33.2 C35.2 C39.1 C40.1 Q1.2(D) Q2.2(D) U13.1(VDD) U13.6(EN) U14.1(VDD) U14.6(EN)
GND: C27.2(-) C28.2(-) C29.2(-) C30.2(-) C31.2 C32.2 C33.1 C35.1 C36.2 C38.1 C39.2 C40.2 GND6.1 GND9.1 Q3.3(S) Q4.3(S) U13.9(VSS) U13.11(Thermal_Pad) U14.9(VSS) U14.11(Thermal_Pad)
DEAD_N: U13.7(HI) U14.8(LI) ; port DEAD_N
DEAD_P: U13.8(LI) U14.7(HI) ; port DEAD_P
Hside_1: Q2.1(G) U13.4(HO)
Hside_2: Q1.1(G) U14.4(HO)
Lside_1: Q4.1(G) U13.10(LO)
Lside_2: Q3.1(G) U14.10(LO)
Vout+: L2.1 Q2.3(S) Q4.2(D)
Vout-: L3.1 Q1.3(S) Q3.2(D)
NetC26_1: C26.1 U13.3(HB)
NetC26_2: C26.2 U13.5(HS)
NetC34_1: C34.1 U14.3(HB)
NetC34_2: C34.2 U14.5(HS)
NetC36_1: C36.1 C37.1 L2.2 OUT_P.1 ; port LOAD_P
NetC37_2: C37.2 C38.2 L3.2 OUT_N.1 ; port LOAD_N

Not connected (* = marked no-connect by the designer): U13 2(NC)*; U14 2(NC)*

### Notes on the sheet
- f_cutoff = 31kHz
- 4om load!!
- Project Name:
- Company Confidential / Not for distribution!
- Document Name:
- Designer Name:
- Date/Time:
- Revision:

### Library data of the parts
C26 C34 = Capacitor: Dielectric: X7R; Volatge: 50; Manufacturer: *; Part Number: *; Value: 100n
C27-C30 = EEEFK1E471P: Capacitor Polarised; Manufacturer_Name: Panasonic; Datasheet Link: http://industrial.panasonic.com/cdbs/www-data/pdf/RDE0000/ABA0000C1181.pdf; Manufacturer_Part_Number: EEEFK1E471P; Mouser Part Number: 667-EEE-FK1E471P; Mouser Price/Stock: http://www.mouser.com/Search/ProductDetail.aspx?qs=qE6bgDGEOCvvsolWS4cebg%3d%3d; Arrow Part Number: EEEFK1E471P; Arrow Price/Stock: https://www.arrow.com/en/products/eee-fk1e471p/panasonic
  C27: Value: 470u
C31 C32 C39 C40 = Capacitor: Manufacturer: *; Part Number: *
  C31 C32: Value: 4.7u
  C39 C40: Value: 100n
C33 C35 = Capacitor: Dielectric: X7R; Volatge: 25; Manufacturer: *; Part Number: *; Value: 1n
C36-C38 = Capacitor: Dielectric: X7R; Voltage: 50; Manufacturer: *; Part Number: *
  C36 C38: Value: 180n
  C37: Value: 1u
GND6 GND9 OUT_N OUT_P = TestPoint: Test Point
L2 L3 = SRR1208-220ML_inductor: Inductor SMD; 22uH; Ioperation: 3.5A; R: 43mΩ; ±20%; Isat: 4A; Manufacturer_Name: BOURNS; TME Electronic Components Part Number: *; TME Electronic Components Price/Stock: *; Manufacturer_Part_Number: SRR1208-220ML; Value: 22u
Q1-Q4 = IRFZ24NPBF: HEXFET POWER MOSFET N-CHANNEL; Manufacturer_Name: Infineon; Geometry.Height: 4.69mm; TME Electronic Components Part Number: *; TME Electronic Components Price/Stock: *; Manufacturer_Part_Number: IRFZ24NPBF; Datasheet Link: *
U13 U14 = UCC27282DRCT: IC GATE DRVR HALF-BRIDGE 10VSON; RoHS Compliant: Yes